# EAGLE design MQBoard (EAGLE 8.5.1)
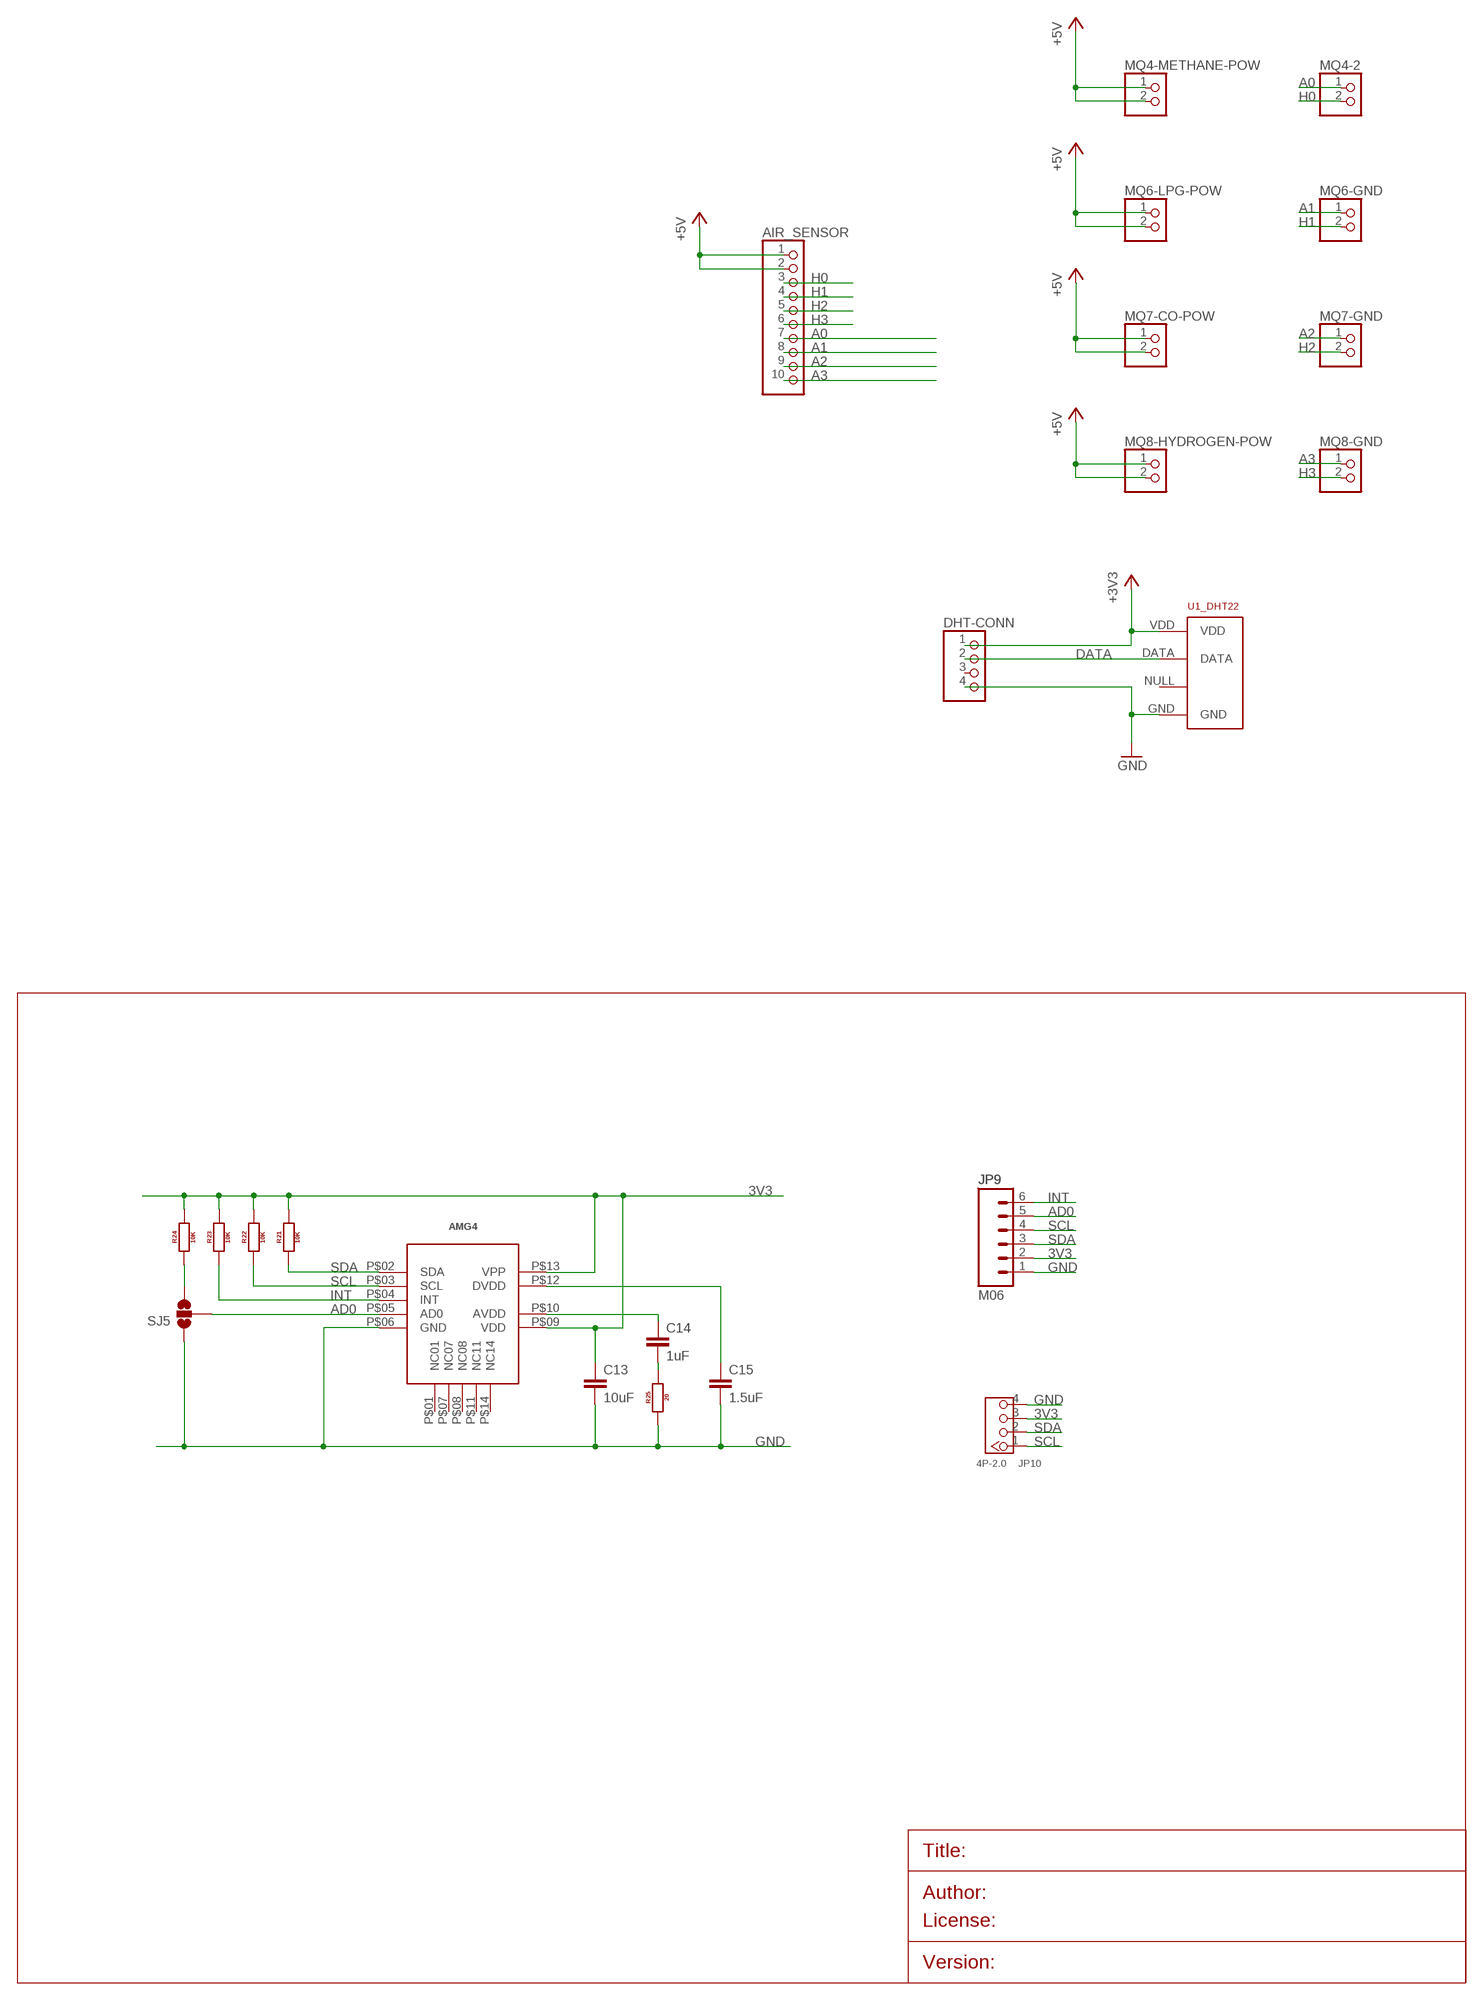
[diagram p0: schematic, sheet 1, part 1 of 2]
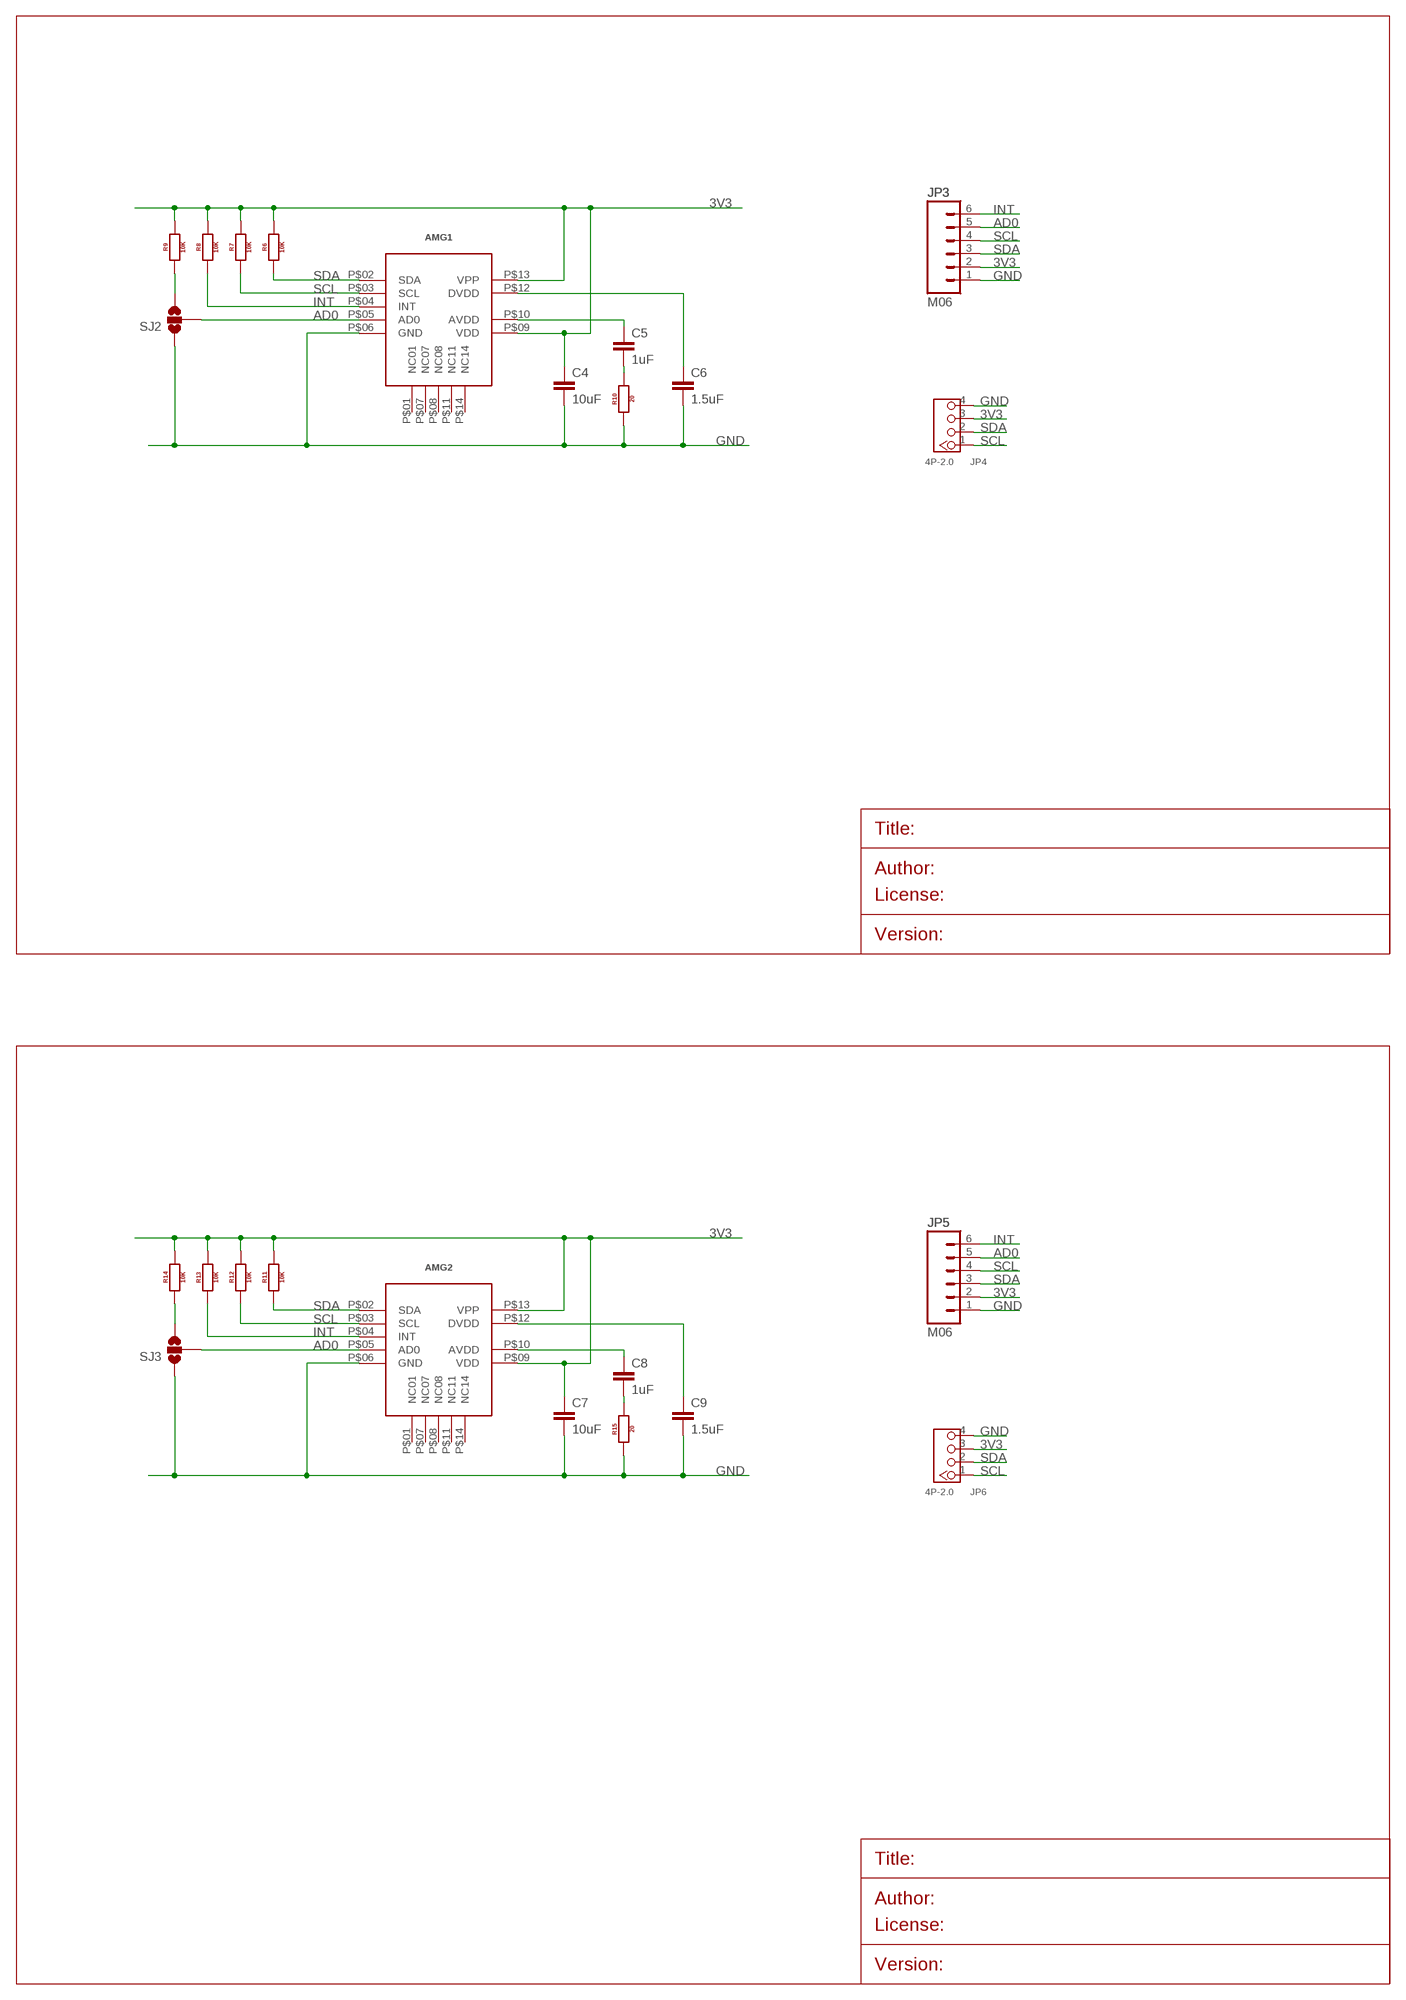
[diagram p1: schematic, sheet 1, part 2 of 2]

## Parts
AIR_SENSOR  PINHD-1X10  [1X10]
AMG1  AMG88XX  [AMG88XX]
AMG2  AMG88XX  [AMG88XX]
AMG4  AMG88XX  [AMG88XX]
C4  10uF  C-EU0805  [0805]
C5  1uF  C-EU0805  [0805]
C6  1.5uF  C-EU0805  [0805]
C7  10uF  C-EU0805  [0805]
C8  1uF  C-EU0805  [0805]
C9  1.5uF  C-EU0805  [0805]
C13  10uF  C-EU0805  [0805]
C14  1uF  C-EU0805  [0805]
C15  1.5uF  C-EU0805  [0805]
DHT-CONN  PINHD-1X4  [1X04]
JP3  M06  [1X06_NO_SILK]
JP4  4P-2.0  GROVE-CONNECTOR-DIP(4P-2.0)  [HW4-2.0]
JP5  M06  [1X06_NO_SILK]
JP6  4P-2.0  GROVE-CONNECTOR-DIP(4P-2.0)  [HW4-2.0]
JP9  M06  [1X06_NO_SILK]
JP10  4P-2.0  GROVE-CONNECTOR-DIP(4P-2.0)  [HW4-2.0]
MQ4-2  PINHD-1X2  [1X02]
MQ4-METHANE-POW  PINHD-1X2  [1X02]
MQ6-GND  PINHD-1X2  [1X02]
MQ6-LPG-POW  PINHD-1X2  [1X02]
MQ7-CO-POW  PINHD-1X2  [1X02]
MQ7-GND  PINHD-1X2  [1X02]
MQ8-GND  PINHD-1X2  [1X02]
MQ8-HYDROGEN-POW  PINHD-1X2  [1X02]
R6  10K  RESISTOR0805  [0805]
R7  10K  RESISTOR0805  [0805]
R8  10K  RESISTOR0805  [0805]
R9  10K  RESISTOR0805  [0805]
R10  20  RESISTOR0805  [0805]
R11  10K  RESISTOR0805  [0805]
R12  10K  RESISTOR0805  [0805]
R13  10K  RESISTOR0805  [0805]
R14  10K  RESISTOR0805  [0805]
R15  20  RESISTOR0805  [0805]
R21  10K  RESISTOR0805  [0805]
R22  10K  RESISTOR0805  [0805]
R23  10K  RESISTOR0805  [0805]
R24  10K  RESISTOR0805  [0805]
R25  20  RESISTOR0805  [0805]
SJ2  SOLDERJUMPER_2WAYS  [SJ_3]
SJ3  SOLDERJUMPER_2WAYS  [SJ_3]
SJ5  SOLDERJUMPER_2WAYS  [SJ_3]
U1_DHT22  RHT03_DHT-22_AM2302  [RHT03_DHT-22]

## Nets
3V3: AMG1.P$09(VDD) AMG1.P$13(VPP) AMG2.P$09(VDD) AMG2.P$13(VPP) AMG4.P$09(VDD) AMG4.P$13(VPP) C4.1 C7.1 C13.1 JP3.2 JP4.3 JP5.2 JP6.3 JP9.2 JP10.3 R6.2 R7.2 R8.2 R9.2 R11.2 R12.2 R13.2 R14.2 R21.2 R22.2 R23.2 R24.2
+3V3: DHT-CONN.1 U1_DHT22.VDD
+5V: AIR_SENSOR.1 AIR_SENSOR.2 MQ4-METHANE-POW.1 MQ4-METHANE-POW.2 MQ6-LPG-POW.1 MQ6-LPG-POW.2 MQ7-CO-POW.1 MQ7-CO-POW.2 MQ8-HYDROGEN-POW.1 MQ8-HYDROGEN-POW.2
A0: AIR_SENSOR.7 MQ4-2.1
A1: AIR_SENSOR.8 MQ6-GND.1
A2: AIR_SENSOR.9 MQ7-GND.1
A3: AIR_SENSOR.10 MQ8-GND.1
AD0: AMG1.P$05(AD0) AMG2.P$05(AD0) AMG4.P$05(AD0) JP3.5 JP5.5 JP9.5 SJ2.2 SJ3.2 SJ5.2
DATA: DHT-CONN.2 U1_DHT22.DATA
GND: AMG1.P$06(GND) AMG2.P$06(GND) AMG4.P$06(GND) C4.2 C6.2 C7.2 C9.2 C13.2 C15.2 DHT-CONN.4 JP3.1 JP4.4 JP5.1 JP6.4 JP9.1 JP10.4 R10.1 R15.1 R25.1 SJ2.1 SJ3.1 SJ5.1 U1_DHT22.GND
H0: AIR_SENSOR.3 MQ4-2.2
H1: AIR_SENSOR.4 MQ6-GND.2
H2: AIR_SENSOR.5 MQ7-GND.2
H3: AIR_SENSOR.6 MQ8-GND.2
INT: AMG1.P$04(INT) AMG2.P$04(INT) AMG4.P$04(INT) JP3.6 JP5.6 JP9.6 R8.1 R13.1 R23.1
N$1: AMG1.P$12(DVDD) C6.1
N$4: AMG1.P$10(AVDD) C5.1
N$5: R9.1 SJ2.3
N$6: C5.2 R10.2
N$9: AMG2.P$12(DVDD) C9.1
N$10: AMG2.P$10(AVDD) C8.1
N$11: R14.1 SJ3.3
N$12: C8.2 R15.2
N$17: AMG4.P$12(DVDD) C15.1
N$18: AMG4.P$10(AVDD) C14.1
N$19: R24.1 SJ5.3
N$20: C14.2 R25.2
SCL: AMG1.P$03(SCL) AMG2.P$03(SCL) AMG4.P$03(SCL) JP3.4 JP4.1 JP5.4 JP6.1 JP9.4 JP10.1 R7.1 R12.1 R22.1
SDA: AMG1.P$02(SDA) AMG2.P$02(SDA) AMG4.P$02(SDA) JP3.3 JP4.2 JP5.3 JP6.2 JP9.3 JP10.2 R6.1 R11.1 R21.1
Unconnected: AMG1.P$01(NC01) AMG1.P$07(NC07) AMG1.P$08(NC08) AMG1.P$11(NC11) AMG1.P$14(NC14) AMG2.P$01(NC01) AMG2.P$07(NC07) AMG2.P$08(NC08) AMG2.P$11(NC11) AMG2.P$14(NC14) AMG4.P$01(NC01) AMG4.P$07(NC07) AMG4.P$08(NC08) AMG4.P$11(NC11) AMG4.P$14(NC14) DHT-CONN.3 U1_DHT22.NULL

## Library data of the parts
AIR_SENSOR = pinhead:PINHD-1X10: PIN HEADER
AMG1 AMG2 AMG4 = xose:AMG88XX
C4-C9 C13-C15 = xose:C-EU: CAPACITOR, European symbol
DHT-CONN = pinhead:PINHD-1X4: PIN HEADER
JP3 JP5 JP9 = xose:M06
JP4 JP6 JP10 = Seeed-Connector -2016:GROVE-CONNECTOR-DIP(4P-2.0): 320110033
MQ4-2 MQ4-METHANE-POW MQ6-GND MQ6-LPG-POW MQ7-CO-POW MQ7-GND MQ8-GND MQ8-HYDROGEN-POW = pinhead:PINHD-1X2: PIN HEADER
R6-R15 R21-R25 = xose:RESISTOR: Generic EU resistor symbol
SJ2 SJ3 SJ5 = xose:SOLDERJUMPER_2WAY: Solder Jumper 2 way solder jumper
U1_DHT22 = RHT03_DHT-22_AM2302:RHT03_DHT-22_AM2302: RHT03 / DHT-22 / AM2302 Packages and symbol for the RHT03 / DHT-22 relative humidity and temperature sensor. Note: The AM2302 is a wired version of the DHT-22 which typically requires less clearance and is thus provided as a separate package.; PROD_ID: SEN-10167

## Board
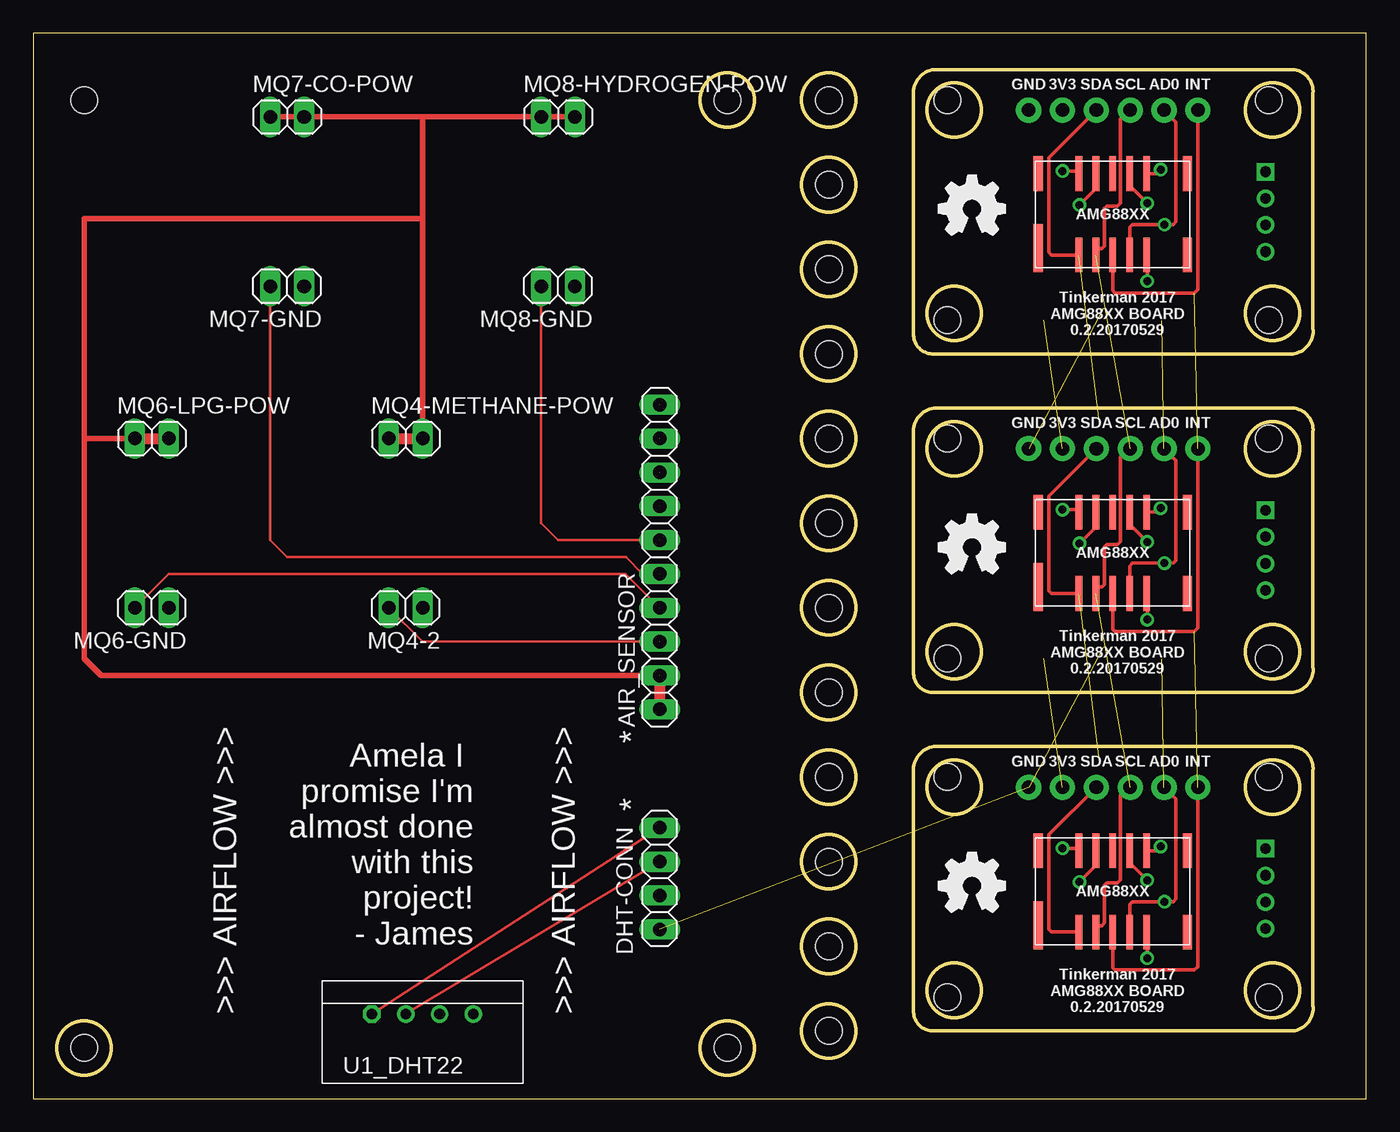
[diagram p2: board, top side]
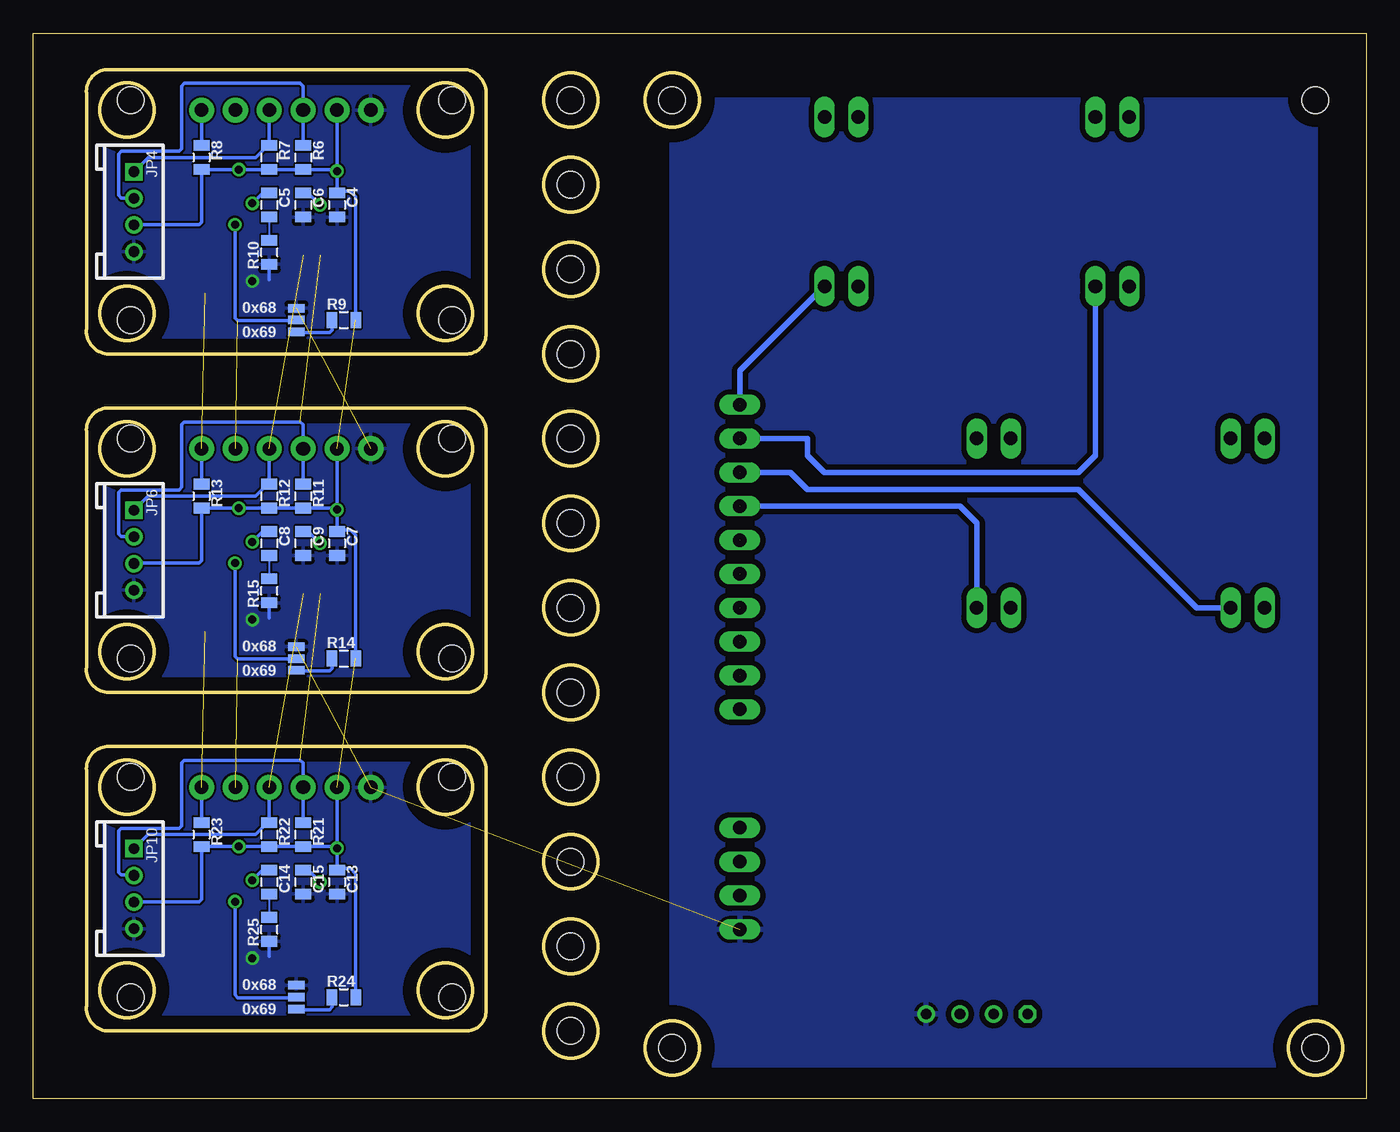
[diagram p3: board, bottom side, seen from below]

Size 100 x 79.93 mm. Coordinates in mm from the lower left corner, seen from the top.
Outline: 0,0 100,0 100,79.93 0,79.93 0,0
Outline: 66.04,57.4 66.04,75.18 arc-90 67.56,77.22 94.49,77.22 arc-90 96.01,75.44 96.01,57.78 arc-90 94.49,55.88 67.44,55.88 arc-90 66.04,57.4
Outline: 66.04,32 66.04,49.78 arc-90 67.56,51.82 94.49,51.82 arc-90 96.01,50.04 96.01,32.38 arc-90 94.49,30.48 67.44,30.48 arc-90 66.04,32
Outline: 66.04,6.6 66.04,24.38 arc-90 67.56,26.42 94.49,26.42 arc-90 96.01,24.64 96.01,6.99 arc-90 94.49,5.08 67.44,5.08 arc-90 66.04,6.6
Outline: circle at 69.09,58.93 radius 2.03
Outline: circle at 69.09,74.17 radius 2.03
Outline: circle at 92.96,74.17 radius 2.03
Outline: circle at 92.96,58.93 radius 2.03
Outline: circle at 69.09,33.53 radius 2.03
Outline: circle at 69.09,48.77 radius 2.03
Outline: circle at 92.96,48.77 radius 2.03
Outline: circle at 92.96,33.53 radius 2.03
Outline: circle at 69.09,8.13 radius 2.03
Outline: circle at 69.09,23.37 radius 2.03
Outline: circle at 92.96,23.37 radius 2.03
Outline: circle at 92.96,8.13 radius 2.03
Outline: circle at 52.07,74.93 radius 2.03
Outline: circle at 3.81,3.81 radius 2.03
Outline: circle at 52.07,3.81 radius 2.03
Outline: circle at 59.69,74.93 radius 2.03
Outline: circle at 59.69,68.58 radius 2.03
Outline: circle at 59.69,62.23 radius 2.03
Outline: circle at 59.69,55.88 radius 2.03
Outline: circle at 59.69,49.53 radius 2.03
Copper layers (1*16): Top 0.035mm / dielectric 1.5mm / Bottom 0.035mm
Design rules "default": minimum track width 6mil, minimum drill 0.35mm, track to track 6mil, track to pad 6mil, pad to pad 6mil, via to via 6mil, smd to smd 6mil, copper to edge 40mil, drill to drill 6mil, minimum pad ring 10mil, minimum via ring 8mil, stop-mask expansion 4mil, vias tented up to drill 0mil, thermal gap 10mil
Holes 2 mm at 3.81,74.93 52.07,74.93 59.69,74.93 59.69,68.58 59.69,62.23 59.69,55.88 59.69,49.53 59.69,43.18 59.69,36.83 3.81,3.81 52.07,3.81 59.69,5.08 59.69,11.43 59.69,17.78 59.69,24.13 59.69,30.48 92.71,24.13 68.58,24.13 68.58,7.62 92.71,7.62 68.58,33.02 92.71,33.02 68.58,49.53 92.71,49.53 68.58,74.93 92.71,74.93 92.71,58.42 68.58,58.42

### Footprints (pad centres in the part's own frame; a part is rotated, then mirrored left to right if it is on the bottom)
1X10 = drill 1.016 long: 1 -11.43,0; 2 -8.89,0; 3 -6.35,0; 4 -3.81,0; 5 -1.27,0; 6 1.27,0; 7 3.81,0; 8 6.35,0; 9 8.89,0; 10 11.43,0
AMG88XX = smd 0.7 x 3.6: P$01 0.2,1.45 | smd 0.5 x 2.6: P$02 3.26,0.95; P$03 4.53,0.95; P$04 5.8,0.95; P$05 7.07,0.95; P$06 8.34,0.95; P$09 8.34,7.05; P$10 7.07,7.05; P$11 5.8,7.05; P$12 4.53,7.05; P$13 3.26,7.05 | smd 0.7 x 2.6: P$07 11.4,0.95; P$08 11.4,7.05; P$14 0.2,7.05
0805 = smd 0.8 x 1.2: 1 -0.9,0; 2 0.9,0
1X04 = drill 1.016 long: 1 -3.81,0; 2 -1.27,0; 3 1.27,0; 4 3.81,0
1X06_NO_SILK = drill 1.016 pad 1.88: 1 0,0; 2 2.54,0; 3 5.08,0; 4 7.62,0; 5 10.16,0; 6 12.7,0
HW4-2.0 = drill 0.8 pad 1.27 square: 1 -3,0 | drill 0.8 pad 1.27: 2 -1,0; 3 1,0; 4 3,0
1X02 = drill 1.016 long: 1 -1.27,0; 2 1.27,0
SJ_3 = smd 0.635 x 1.27: 1 -0.889,0; 2 0,0; 3 0.889,0
RHT03_DHT-22 = drill 0.8: DATA -1.27,0; GND 3.81,0; NULL 1.27,0 | drill 0.8 octagon: VDD -3.81,0

### Placement (x,y rotation side)
AIR_SENSOR  46.99,40.64 90 top
AMG1  75.18,62.36 0 top
AMG2  75.18,36.96 0 top
AMG4  75.18,11.56 0 top
C4  77.22,67.06 270 bottom
C5  82.3,67.06 270 bottom
C6  79.76,67.06 270 bottom
C7  77.22,41.66 270 bottom
C8  82.3,41.66 270 bottom
C9  79.76,41.66 270 bottom
C13  77.22,16.26 270 bottom
C14  82.3,16.26 270 bottom
C15  79.76,16.26 270 bottom
DHT-CONN  46.99,16.51 270 top
JP3  74.68,74.17 0 top
JP4  92.46,66.55 270 bottom
JP5  74.68,48.77 0 top
JP6  92.46,41.15 270 bottom
JP9  74.68,23.37 0 top
JP10  92.46,15.75 270 bottom
MQ4-2  27.94,36.83 180 top
MQ4-METHANE-POW  27.94,49.53 0 top
MQ6-GND  8.89,36.83 180 top
MQ6-LPG-POW  8.89,49.53 0 top
MQ7-CO-POW  19.05,73.66 0 top
MQ7-GND  19.05,60.96 180 top
MQ8-GND  39.37,60.96 180 top
MQ8-HYDROGEN-POW  39.37,73.66 0 top
R6  79.76,70.61 270 bottom
R7  82.3,70.61 270 bottom
R8  87.38,70.61 270 bottom
R9  76.71,58.42 0 bottom
R10  82.3,63.5 90 bottom
R11  79.76,45.21 270 bottom
R12  82.3,45.21 270 bottom
R13  87.38,45.21 270 bottom
R14  76.71,33.02 0 bottom
R15  82.3,38.1 90 bottom
R21  79.76,19.81 270 bottom
R22  82.3,19.81 270 bottom
R23  87.38,19.81 270 bottom
R24  76.71,7.62 0 bottom
R25  82.3,12.7 90 bottom
SJ2  80.26,58.42 270 bottom
SJ3  80.26,33.02 270 bottom
SJ5  80.26,7.62 270 bottom
U1_DHT22  29.21,6.35 0 top

### Tracks (layer width: path | path; a pad name or v marks a point on that pad's centre or on a via)
3V3  (via drill 0.6)  (2 unrouted)
  Top 0.152: 78.33,69.6 AMG1.P$13 | 78.33,44.2 AMG2.P$13 | 78.33,18.8 AMG4.P$13
  Top 0.254: v77.22,69.6 78.33,69.6 | 83.57,69.41 AMG1.P$09 84.28,69.41 v84.58,69.71 | v77.22,44.2 78.33,44.2 | 83.57,44.01 AMG2.P$09 84.28,44.01 v84.58,44.31 | v77.22,18.8 78.33,18.8 | 83.57,18.61 AMG4.P$09 84.28,18.61 v84.58,18.91
  Bottom 0.152: 77.1,68.07 C4.1 | 92.42,65.58 JP4.3 | 77.1,42.67 C7.1 | 92.42,40.18 JP6.3 | 77.1,17.27 C13.1 | 92.42,14.78 JP10.3 | 77.33,69.71 77.22,69.71 v77.22,69.6 77.33,69.71 | 77.33,44.31 77.22,44.31 v77.22,44.2 77.33,44.31 | 77.33,18.91 77.22,18.91 v77.22,18.8 77.33,18.91
  Bottom 0.254: JP3.2 v77.22,69.6 C4.1 | 77.33,69.71 R6.2 R7.2 v84.58,69.71 R8.2 87.38,65.77 87.56,65.58 92.42,65.58 | R9.2 75.81,67.68 76.2,68.07 77.1,68.07 | JP5.2 v77.22,44.2 C7.1 | 77.33,44.31 R11.2 R12.2 v84.58,44.31 R13.2 87.38,40.37 87.56,40.18 92.42,40.18 | R14.2 75.81,42.28 76.2,42.67 77.1,42.67 | JP9.2 v77.22,18.8 C13.1 | 77.33,18.91 R21.2 R22.2 v84.58,18.91 R23.2 87.38,14.97 87.56,14.78 92.42,14.78 | R24.2 75.81,16.88 76.2,17.27 77.1,17.27
+3V3
  Top 0.203: U1_DHT22.VDD DHT-CONN.1
+5V  (1 unrouted)
  Top 0.406: AIR_SENSOR.2 5.08,31.75 3.81,33.02 3.81,49.53 | 3.81,49.53 3.81,66.04 29.21,66.04 | 29.21,66.04 29.21,73.66 | 29.21,73.66 MQ7-CO-POW.2 MQ7-CO-POW.1 | 29.21,73.66 MQ8-HYDROGEN-POW.1 MQ8-HYDROGEN-POW.2 | 29.21,66.04 MQ4-METHANE-POW.2 29.21,48.26 | MQ6-LPG-POW.1 3.81,49.53
  Top 0.813: AIR_SENSOR.2 AIR_SENSOR.1 | MQ6-LPG-POW.1 MQ6-LPG-POW.2 | MQ4-METHANE-POW.1 MQ4-METHANE-POW.2
A0  (1 unrouted)
  Bottom 0.406: MQ4-2.1 29.21,43.18 30.48,44.45 | 30.48,44.45 | 30.48,44.45 AIR_SENSOR.7
A1  (1 unrouted)
  Bottom 0.406: MQ6-GND.1 12.7,36.83 21.59,45.72 41.91,45.72 43.18,46.99 AIR_SENSOR.8 | AIR_SENSOR.8
A2  (1 unrouted)
  Bottom 0.406: MQ7-GND.1 20.32,48.26 21.59,46.99 40.64,46.99 41.91,48.26 41.91,49.53 AIR_SENSOR.9 | AIR_SENSOR.9
A3  (1 unrouted)
  Bottom 0.406: MQ8-GND.1 46.99,54.61 AIR_SENSOR.10
AD0  (via drill 0.6)  (2 unrouted)
  Top 0.254: AMG1.P$05 82.26,65.38 82.46,65.58 v84.86,65.58 | v84.86,65.58 84.84,65.58 | v84.86,65.58 85.52,65.58 85.72,65.79 85.72,73.28 JP3.5 | AMG2.P$05 82.26,39.98 82.46,40.18 v84.86,40.18 | v84.86,40.18 84.84,40.18 | v84.86,40.18 85.52,40.18 85.72,40.39 85.72,47.88 JP5.5 | AMG4.P$05 82.26,14.58 82.46,14.78 v84.86,14.78 | v84.86,14.78 84.84,14.78 | v84.86,14.78 85.52,14.78 85.72,14.99 85.72,22.48 JP9.5
  Bottom 0.152: 80.3,58.38 SJ2.2 | 80.3,32.98 SJ3.2 | 80.3,7.58 SJ5.2
  Bottom 0.254: v84.86,65.58 84.86,58.58 84.66,58.38 80.3,58.38 | v84.86,40.18 84.86,33.18 84.66,32.98 80.3,32.98 | v84.86,14.78 84.86,7.78 84.66,7.58 80.3,7.58
DATA
  Top 0.203: U1_DHT22.DATA DHT-CONN.2
GND  (via drill 0.6)  (3 unrouted)
  Top 0.254: AMG1.P$06 83.57,63.31 v83.57,61.34 | AMG2.P$06 83.57,37.91 v83.57,35.94 | AMG4.P$06 83.57,12.51 v83.57,10.54
  Bottom 0.152: 82.42,62.48 R10.1 | 82.42,37.08 R15.1 | 82.42,11.68 R25.1
  Bottom 0.254: R10.1 82.3,61.47 | R15.1 82.3,36.07 | R25.1 82.3,10.67
  pour Bottom: 65.53,77.72 98.04,77.72 98.04,55.37 65.53,55.37
  pour Bottom: 65.53,52.32 98.04,52.32 98.04,29.97 65.53,29.97
  pour Bottom: 65.53,26.92 98.04,26.92 98.04,4.57 65.53,4.57
  pour Bottom (isolate 0.406): 3.81,74.93 52.07,74.93 52.07,2.54 5.08,2.54 3.81,3.81
H0  (1 unrouted)
  Top 0.203: MQ4-2.2 29.21,34.29 AIR_SENSOR.3
H1  (1 unrouted)
  Top 0.203: MQ6-GND.2 10.16,39.37 44.45,39.37 AIR_SENSOR.4
H2  (1 unrouted)
  Top 0.203: MQ7-GND.2 17.78,41.91 19.05,40.64 44.45,40.64 45.72,39.37 AIR_SENSOR.5
H3  (1 unrouted)
  Top 0.203: MQ8-GND.2 38.1,43.18 39.37,41.91 AIR_SENSOR.6
INT  (2 unrouted)
  Top 0.254: AMG1.P$04 80.98,60.62 81.15,60.45 87.12,60.45 87.38,60.71 JP3.6 | AMG2.P$04 80.98,35.22 81.15,35.05 87.12,35.05 87.38,35.31 JP5.6 | AMG4.P$04 80.98,9.82 81.15,9.65 87.12,9.65 87.38,9.91 JP9.6
  Bottom 0.254: R8.1 JP3.6 | R13.1 JP5.6 | R23.1 JP9.6
N$1  (via drill 0.6)
  Top 0.254: AMG1.P$12 79.71,68.28 v78.49,67.06
  Bottom 0.254: C6.1 79.39,67.96 v78.49,67.06
N$4  (via drill 0.6)
  Top 0.254: AMG1.P$10 82.25,68.5 v83.57,67.18
  Bottom 0.254: v83.57,67.18 82.79,67.96 C5.1
N$5
  Bottom 0.152: 80.21,57.48 SJ2.3 | 77.56,58.38 R9.1
  Bottom 0.254: 80.21,57.48 77.76,57.48 77.56,57.68 77.56,58.38
N$6
  Bottom 0.152: C5.2 R10.2
N$9  (via drill 0.6)
  Top 0.254: AMG2.P$12 79.71,42.88 v78.49,41.66
  Bottom 0.254: C9.1 79.39,42.56 v78.49,41.66
N$10  (via drill 0.6)
  Top 0.254: AMG2.P$10 82.25,43.09 v83.57,41.78
  Bottom 0.254: v83.57,41.78 82.79,42.56 C8.1
N$11
  Bottom 0.152: 80.21,32.08 SJ3.3 | 77.56,32.98 R14.1
  Bottom 0.254: 80.21,32.08 77.76,32.08 77.56,32.28 77.56,32.98
N$12
  Bottom 0.152: C8.2 R15.2
N$17  (via drill 0.6)
  Top 0.254: AMG4.P$12 79.71,17.48 v78.49,16.26
  Bottom 0.254: C15.1 79.39,17.16 v78.49,16.26
N$18  (via drill 0.6)
  Top 0.254: AMG4.P$10 82.25,17.7 v83.57,16.38
  Bottom 0.254: v83.57,16.38 82.79,17.16 C14.1
N$19
  Bottom 0.152: 80.21,6.68 SJ5.3 | 77.56,7.58 R24.1
  Bottom 0.254: 80.21,6.68 77.76,6.68 77.56,6.88 77.56,7.58
N$20
  Bottom 0.152: C14.2 R25.2
SCL  (2 unrouted)
  Top 0.152: 79.75,63.78 AMG1.P$03 | 79.75,38.38 AMG2.P$03 | 79.75,12.98 AMG4.P$03
  Top 0.254: JP3.4 81.56,73.54 81.56,67.2 81.34,66.98 80.54,66.98 80.36,66.8 80.36,63.98 80.16,63.78 79.75,63.78 | JP5.4 81.56,48.14 81.56,41.8 81.34,41.58 80.54,41.58 80.36,41.4 80.36,38.58 80.16,38.38 79.75,38.38 | JP9.4 81.56,22.74 81.56,16.4 81.34,16.18 80.54,16.18 80.36,16 80.36,13.18 80.16,12.98 79.75,12.98
  Bottom 0.152: R7.1 82.41,71.51 | R12.1 82.41,46.11 | R22.1 82.41,20.71
  Bottom 0.254: JP3.4 R7.1 | 82.41,71.51 83.31,70.61 91.39,70.61 JP4.1 | JP5.4 R12.1 | 82.41,46.11 83.31,45.21 91.39,45.21 JP6.1 | JP9.4 R22.1 | 82.41,20.71 83.31,19.81 91.39,19.81 JP10.1
SDA  (2 unrouted)
  Top 0.254: AMG1.P$02 76.39,63.31 76.2,63.5 76.2,70.61 JP3.3 | AMG2.P$02 76.39,37.91 76.2,38.1 76.2,45.21 JP5.3 | AMG4.P$02 76.39,12.51 76.2,12.7 76.2,19.81 JP9.3
  Bottom 0.152: 92.49,67.58 JP4.2 | 92.49,42.18 JP6.2 | 92.49,16.78 JP10.2
  Bottom 0.254: R6.1 JP3.3 79.76,75.98 79.96,76.18 88.66,76.18 88.86,75.98 88.86,71.28 89.06,71.08 93.39,71.08 93.59,70.88 93.59,67.78 93.39,67.58 92.49,67.58 | R11.1 JP5.3 79.76,50.58 79.96,50.78 88.66,50.78 88.86,50.58 88.86,45.88 89.06,45.68 93.39,45.68 93.59,45.48 93.59,42.38 93.39,42.18 92.49,42.18 | R21.1 JP9.3 79.76,25.18 79.96,25.38 88.66,25.38 88.86,25.18 88.86,20.48 89.06,20.28 93.39,20.28 93.59,20.08 93.59,16.98 93.39,16.78 92.49,16.78

### Text on the board
tPlace: Tinkerman 2017 / AMG88XX BOARD / 0.2.20170529 | Tinkerman 2017 / AMG88XX BOARD / 0.2.20170529 | Tinkerman 2017 / AMG88XX BOARD / 0.2.20170529
bPlace: 0x68 | 0x69 | 0x68 | 0x69 | 0x68 | 0x69
tNames: GND | 3V3 | SDA | SCL | AD0 | INT | GND | 3V3 | SDA | SCL | AD0 | INT | Amela I / promise I'm / almost done / with this / project! / - James | * | GND | 3V3 | SDA | SCL | AD0 | INT | * | >>> AIRFLOW >>> | >>> AIRFLOW >>>